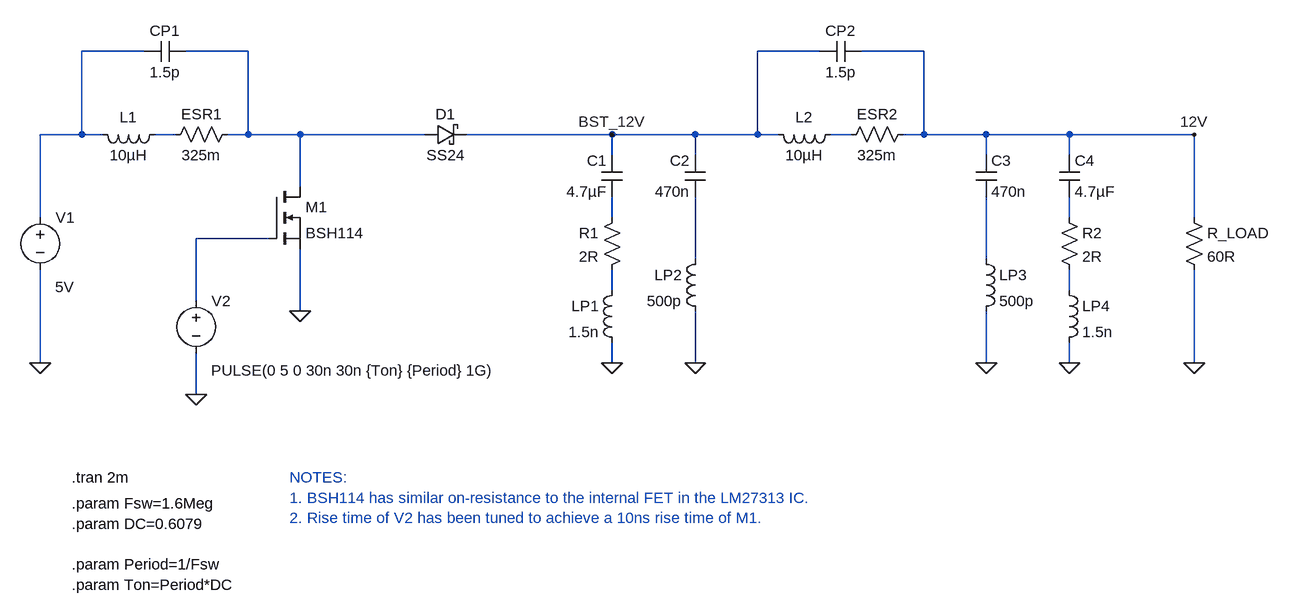
[diagram p0: schematic Boost Converter Transient.asc]
Boost Converter Transient.asc, the LTspice schematic file:
Version 4
SHEET 1 1848 744
WIRE -224 -80 -320 -80
WIRE -64 -80 -160 -80
WIRE 816 -80 720 -80
WIRE 976 -80 880 -80
WIRE -320 48 -320 -80
WIRE -320 48 -384 48
WIRE -288 48 -320 48
WIRE -176 48 -208 48
WIRE -64 48 -64 -80
WIRE -64 48 -96 48
WIRE 16 48 -64 48
WIRE 208 48 16 48
WIRE 496 48 272 48
WIRE 624 48 496 48
WIRE 720 48 720 -80
WIRE 720 48 624 48
WIRE 752 48 720 48
WIRE 864 48 832 48
WIRE 976 48 976 -80
WIRE 976 48 944 48
WIRE 1072 48 976 48
WIRE 1200 48 1072 48
WIRE 1392 48 1200 48
WIRE 496 80 496 48
WIRE 624 80 624 48
WIRE 1072 80 1072 48
WIRE 1200 80 1200 48
WIRE 16 128 16 48
WIRE -384 176 -384 48
WIRE 496 176 496 144
WIRE 1200 176 1200 144
WIRE 1392 176 1392 48
WIRE -32 208 -144 208
WIRE 624 240 624 144
WIRE 1072 240 1072 144
WIRE 496 288 496 256
WIRE 1200 288 1200 256
WIRE -144 304 -144 208
WIRE 16 320 16 224
WIRE -384 400 -384 256
WIRE 496 400 496 368
WIRE 624 400 624 320
WIRE 1072 400 1072 320
WIRE 1200 400 1200 368
WIRE 1392 400 1392 256
WIRE -144 448 -144 384
FLAG -384 400 0
FLAG 1072 400 0
FLAG 1200 400 0
FLAG 624 400 0
FLAG 496 400 0
FLAG 1392 400 0
FLAG 16 320 0
FLAG -144 448 0
FLAG 1392 48 12V
FLAG 496 48 BST_12V
SYMBOL voltage -384 160 R0
WINDOW 3 23 123 Left 2
WINDOW 123 23 95 Left 2
WINDOW 39 0 0 Left 0
SYMATTR Value 5V
SYMATTR InstName V1
SYMBOL ind 848 32 R90
WINDOW 0 5 56 VBottom 2
WINDOW 3 32 56 VTop 2
SYMATTR InstName L2
SYMATTR Value 10µH
SYMBOL res 960 32 R90
WINDOW 0 0 56 VBottom 2
WINDOW 3 32 56 VTop 2
SYMATTR InstName ESR2
SYMATTR Value 325m
SYMBOL cap 880 -96 R90
WINDOW 0 0 32 VBottom 2
WINDOW 3 32 32 VTop 2
SYMATTR InstName CP2
SYMATTR Value 1.5p
SYMBOL cap 1056 80 R0
SYMATTR InstName C3
SYMATTR Value 470n
SYMBOL cap 1184 80 R0
SYMATTR InstName C4
SYMATTR Value 4.7µF
SYMBOL ind 1056 224 R0
SYMATTR InstName LP3
SYMATTR Value 500p
SYMBOL res 1184 160 R0
SYMATTR InstName R2
SYMATTR Value 2R
SYMBOL ind 1184 272 R0
SYMATTR InstName LP4
SYMATTR Value 1.5n
SYMBOL schottky 208 64 R270
WINDOW 0 32 32 VTop 2
WINDOW 3 0 32 VBottom 2
SYMATTR InstName D1
SYMATTR Value SS24
SYMATTR Description Diode
SYMATTR Type diode
SYMBOL cap 640 80 M0
SYMATTR InstName C2
SYMATTR Value 470n
SYMBOL cap 512 80 M0
SYMATTR InstName C1
SYMATTR Value 4.7µF
SYMBOL ind 640 224 M0
SYMATTR InstName LP2
SYMATTR Value 500p
SYMBOL res 512 160 M0
SYMATTR InstName R1
SYMATTR Value 2R
SYMBOL ind 512 272 M0
SYMATTR InstName LP1
SYMATTR Value 1.5n
SYMBOL res 1376 160 R0
SYMATTR InstName R_LOAD
SYMATTR Value 60R
SYMBOL ind -192 32 R90
WINDOW 0 5 56 VBottom 2
WINDOW 3 32 56 VTop 2
SYMATTR InstName L1
SYMATTR Value 10µH
SYMBOL res -80 32 R90
WINDOW 0 0 56 VBottom 2
WINDOW 3 32 56 VTop 2
SYMATTR InstName ESR1
SYMATTR Value 325m
SYMBOL cap -160 -96 R90
WINDOW 0 0 32 VBottom 2
WINDOW 3 32 32 VTop 2
SYMATTR InstName CP1
SYMATTR Value 1.5p
SYMBOL nmos -32 128 R0
SYMATTR InstName M1
SYMATTR Value BSH114
SYMBOL voltage -144 288 R0
WINDOW 3 23 123 Left 2
WINDOW 123 23 95 Left 2
WINDOW 39 0 0 Left 0
SYMATTR Value PULSE(0 5 0 30n 30n {Ton} {Period} 1G)
SYMATTR InstName V2
TEXT 0 576 Left 2 ;NOTES:\n1. BSH114 has similar on-resistance to the internal FET in the LM27313 IC.\n2. Rise time of V2 has been tuned to achieve a 10ns rise time of M1.
TEXT -336 576 Left 2 !.tran 2m
TEXT -336 616 Left 2 !.param Fsw=1.6Meg\n.param DC=0.6079\n \n.param Period=1/Fsw\n.param Ton=Period*DC

The netlist it stands for:
* Boost Converter Transient.asc
V1 N001 0 5V
L2 N004 BST_12V 10µH
R§ESR2 12V N004 325m
CP2 12V BST_12V 1.5p
C3 12V N009 470n
C4 12V N006 4.7µF
LP3 N009 0 500p
R2 N006 N011 2R
LP4 N011 0 1.5n
D1 N002 BST_12V SS24
C2 BST_12V N008 470n
C1 BST_12V N005 4.7µF
LP2 N008 0 500p
R1 N005 N010 2R
LP1 N010 0 1.5n
R_LOAD 12V 0 60R
L1 N003 N001 10µH
R§ESR1 N002 N003 325m
CP1 N002 N001 1.5p
M1 N002 N007 0 0 BSH114
V2 N007 0 PULSE(0 5 0 30n 30n {Ton} {Period} 1G)
.model D D
.lib standard.dio
.model NMOS NMOS
.model PMOS PMOS
.lib standard.mos
* NOTES:
* 1. BSH114 has similar on-resistance to the internal FET in the LM27313 IC.
* 2. Rise time of V2 has been tuned to achieve a 10ns rise time of M1.
.tran 2m
.param Fsw=1.6Meg
.param DC=0.6079
.param Period=1/Fsw
.param Ton=Period*DC
.backanno
.end